# EAGLE design mpl115a2 (EAGLE 7.3.0)
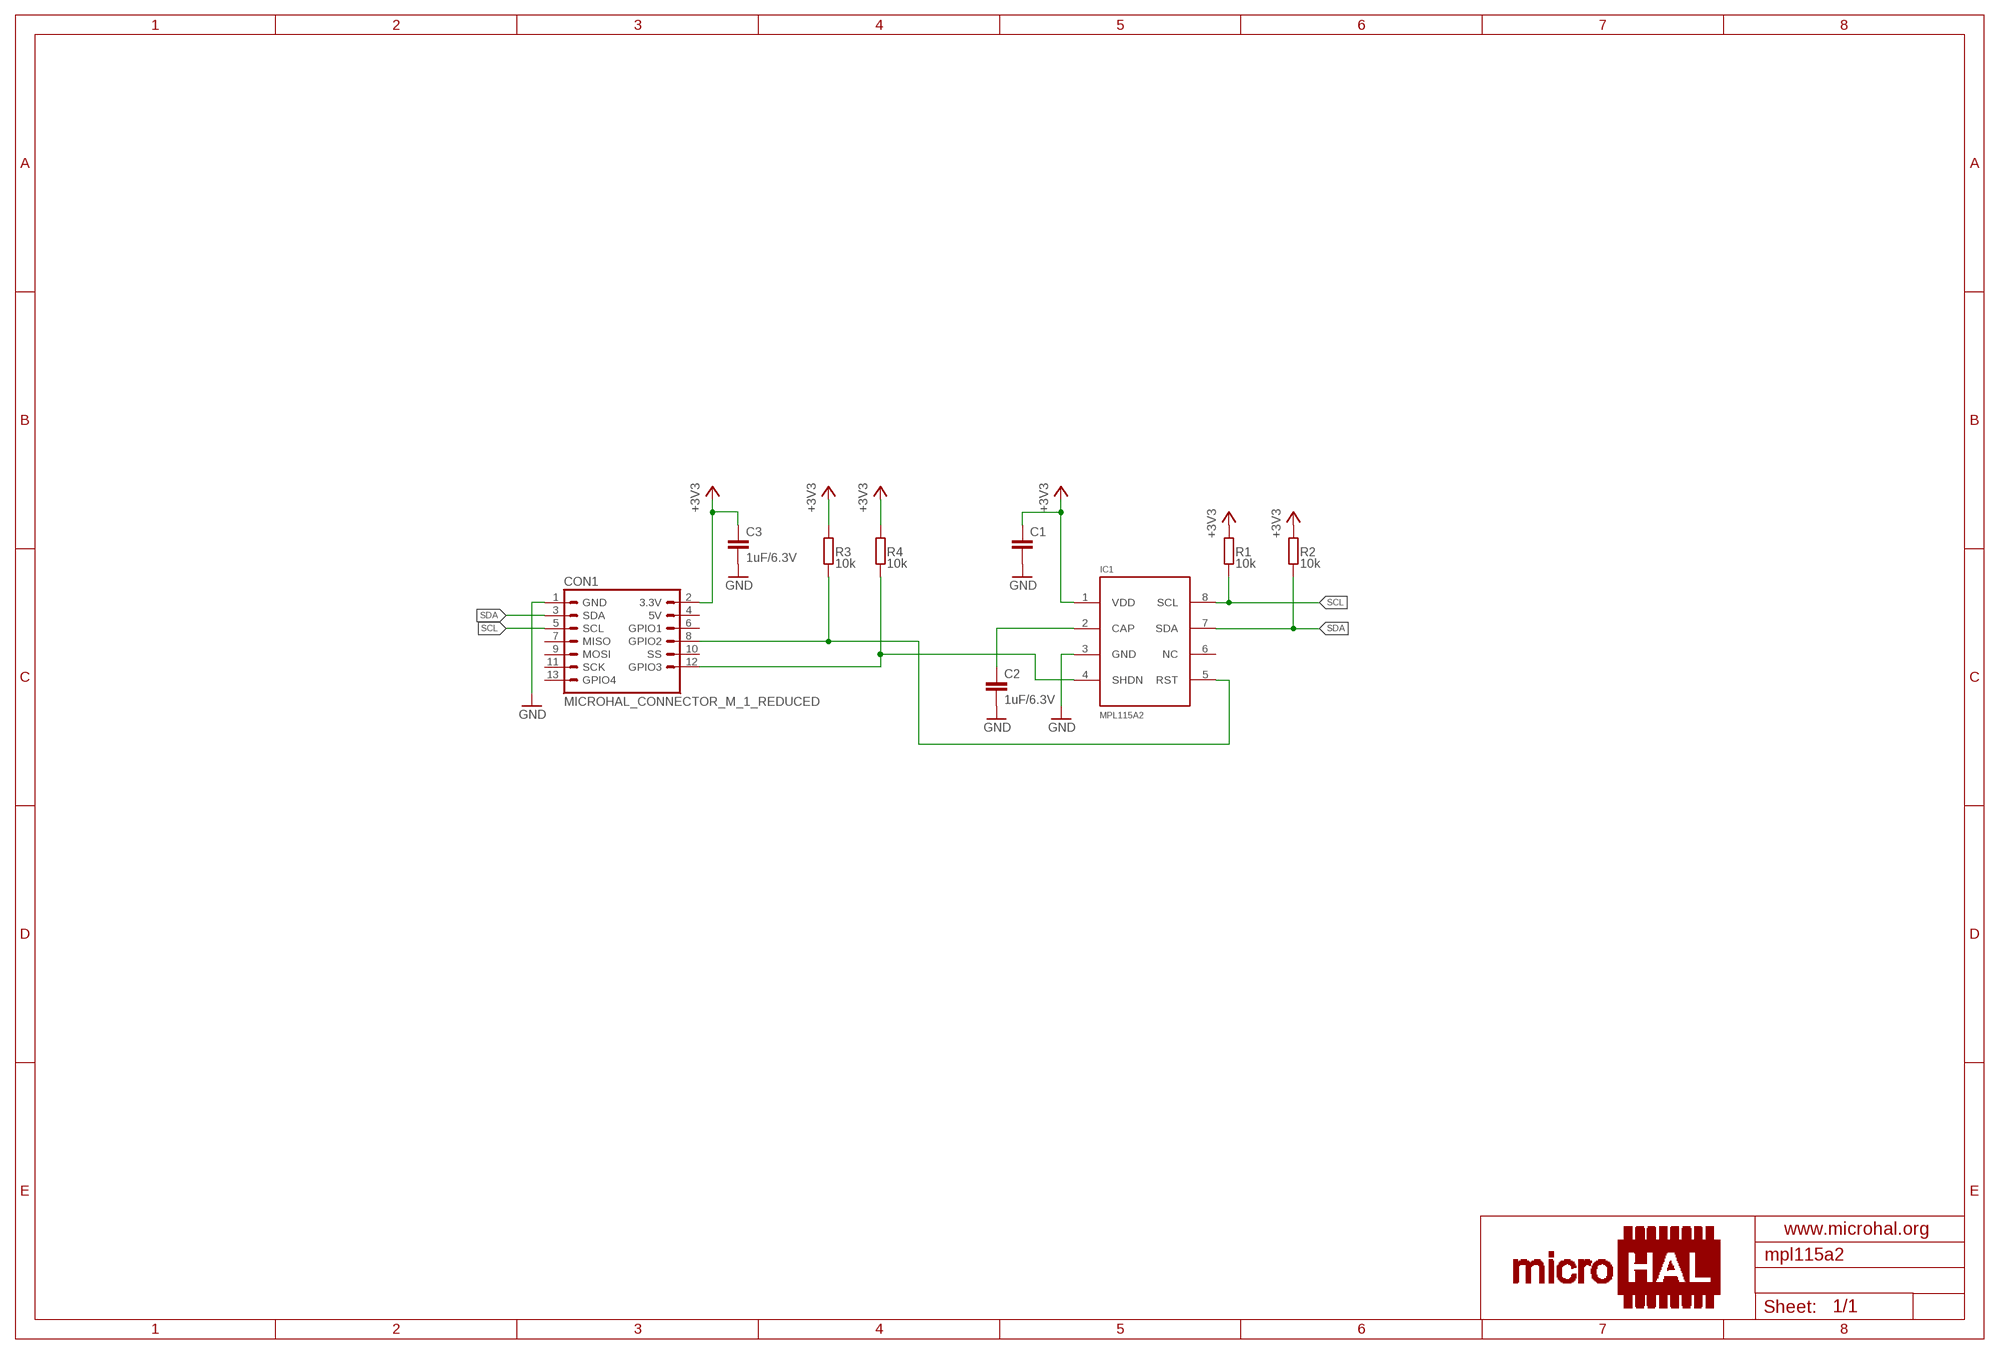
[diagram p0: schematic, sheet 1]

## Parts
C1  C-EUC0603K  [C0603K]
C2  1uF/6.3V  C-EUC0603K  [C0603K]
C3  1uF/6.3V  C-EUC0603K  [C0603K]
CON1  MICROHAL_CONNECTOR_M_1_REDUCED  [MICROHAL_CONNECTOR_M_1_REDUCED_EDGE]
IC1  MPL115A2  [MPL115A2]
R1  10k  R-EU_R0603  [R0603]
R2  10k  R-EU_R0603  [R0603]
R3  10k  R-EU_R0603  [R0603]
R4  10k  R-EU_R0603  [R0603]

## Nets
+3V3: C1.1 C3.1 CON1.2(3.3V) IC1.1(VDD) R1.2 R2.2 R3.2 R4.2
GND: C1.2 C2.2 C3.2 CON1.1(GND) IC1.3(GND)
N$1: CON1.12(GPIO3) IC1.4(SHDN) R4.1
N$2: C2.1 IC1.2(CAP)
N$4: CON1.8(GPIO2) IC1.5(RST) R3.1
SCL: CON1.5(SCL) IC1.8(SCL) R1.1
SDA: CON1.3(SDA) IC1.7(SDA) R2.1
Unconnected: CON1.4(5V) CON1.6(GPIO1) CON1.7(MISO) CON1.9(MOSI) CON1.10(SS) CON1.11(SCK) CON1.13(GPIO4) IC1.6(NC)

## Library data of the parts
C1-C3 = rcl:C-EU: CAPACITOR, European symbol
CON1 = microhal-connector_v0.1:MICROHAL_CONNECTOR_M_1_REDUCED
IC1 = mpl115a2:MPL115A2
R1-R4 = rcl:R-EU_: RESISTOR, European symbol

## Board
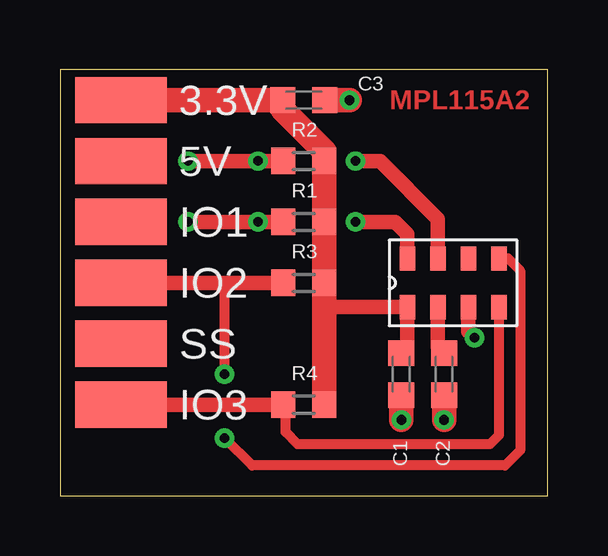
[diagram p1: board, top side]
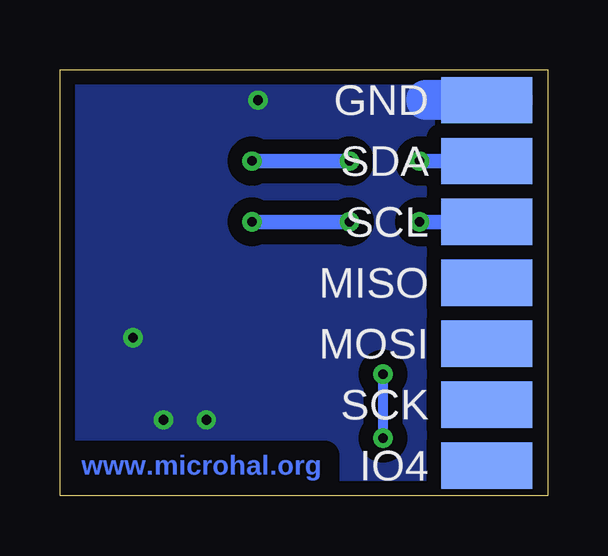
[diagram p2: board, bottom side, seen from below]

Size 20.32 x 17.78 mm. Coordinates in mm from the lower left corner, seen from the top.
Outline: 0,0 20.32,0 20.32,17.78 0,17.78 0,0
Copper layers (1*16): Top 0.035mm / dielectric 1.5mm / Bottom 0.035mm
Design rules "default *": minimum track width 10mil, minimum drill 24mil, track to track 8mil, track to pad 8mil, pad to pad 8mil, via to via 8mil, smd to smd 8mil, copper to edge 20mil, drill to drill 8mil, minimum pad ring 10mil, minimum via ring 8mil, stop-mask expansion 4mil, vias tented up to drill 0mil, thermal gap 10mil

### Footprints (pad centres in the part's own frame; a part is rotated, then mirrored left to right if it is on the bottom)
C0603K = smd 1.05 x 1.08: 1 -0.875,0; 2 0.875,0
MICROHAL_CONNECTOR_M_1_REDUCED_EDGE = smd 1.93 x 3.81 bottom: 1 -7.62,0; 3 -5.08,0; 5 -2.54,0; 7 0,0; 9 2.54,0; 11 5.08,0; 13 7.62,0 | smd 1.93 x 3.81: 2 -7.62,0; 4 -5.08,0; 6 -2.54,0; 8 0,0; 10 2.54,0; 12 5.08,0
MPL115A2 = smd 1.016 x 0.635: 1 -1.016,2.032; 2 -1.016,0.762; 3 -1.016,-0.508; 4 -1.016,-1.778; 5 1.016,-1.778; 6 1.016,-0.508; 7 1.016,0.762; 8 1.016,2.032
R0603 = smd 1 x 1.1: 1 -0.85,0; 2 0.85,0

### Placement (x,y rotation side)
C1  14.22,5.08 270 top
C2  16,5.08 270 top
C3  10.16,16.51 0 top
CON1  2.54,8.89 270 top
IC1  16.51,8.89 90 top
R1  10.16,11.43 0 top
R2  10.16,13.97 0 top
R3  10.16,8.89 0 top
R4  10.16,3.81 0 top

### Tracks (layer width: path | path; a pad name or v marks a point on that pad's centre or on a via)
+3V3
  Top 0.406: 14.48,6.21 C1.1
  Top 0.61: 14.48,6.21 IC1.1 11.01,7.87
  Top 1.016: CON1.2 C3.1 9.29,16.11 11.01,14.39 R2.2 R1.2 R3.2 11.01,7.87 R4.2
GND  (via drill 0.4)
  Top 0.61: IC1.3 17.02,6.86 v17.27,6.6
  Top 1.016: C1.2 v14.22,3.17 | C2.2 v16,3.17 | C3.2 v12.06,16.51
  Bottom 1.676: CON1.1 5.08,16.51
  pour Bottom (isolate 0.61): 0,17.78 20.32,17.78 20.32,0 0,0 0,15.24
N$1
  Top 0.406: IC1.4 18.29,2.54 17.91,2.16 9.91,2.16 9.4,2.67 9.4,3.72 R4.1
  Top 0.61: CON1.12 R4.1
N$2
  Top 0.406: 15.75,6.21 C2.1
  Top 0.61: IC1.2 15.75,6.21
N$4  (via drill 0.4)
  Top 0.406: IC1.5 18.67,9.91 19.18,9.4 19.18,1.91 18.54,1.27 8,1.27 v6.86,2.41 | v6.86,5.08 6.86,8.76 6.73,8.89
  Top 0.61: CON1.8 6.73,8.89 R3.1
  Bottom 0.406: v6.86,2.41 v6.86,5.08
SCL  (via drill 0.4)
  Top 0.61: v5.33,11.43 v8.26,11.43 R1.1 | IC1.8 14.48,10.92 13.97,11.43 v12.32,11.43
  Bottom 0.61: v5.33,11.43 CON1.5 | v12.32,11.43 v8.26,11.43
SDA  (via drill 0.4)
  Top 0.61: R2.1 v8.26,13.97 v5.33,13.97 | IC1.7 15.75,11.56 13.34,13.97 v12.32,13.97
  Bottom 0.61: v5.33,13.97 CON1.3 | v12.32,13.97 v8.26,13.97

### Text on the board
Top: MPL115A2
Bottom: www.microhal.org
tStop: MPL115A2
bStop: www.microhal.org